# EAGLE schematic servo_1 (EAGLE 6.5.0)
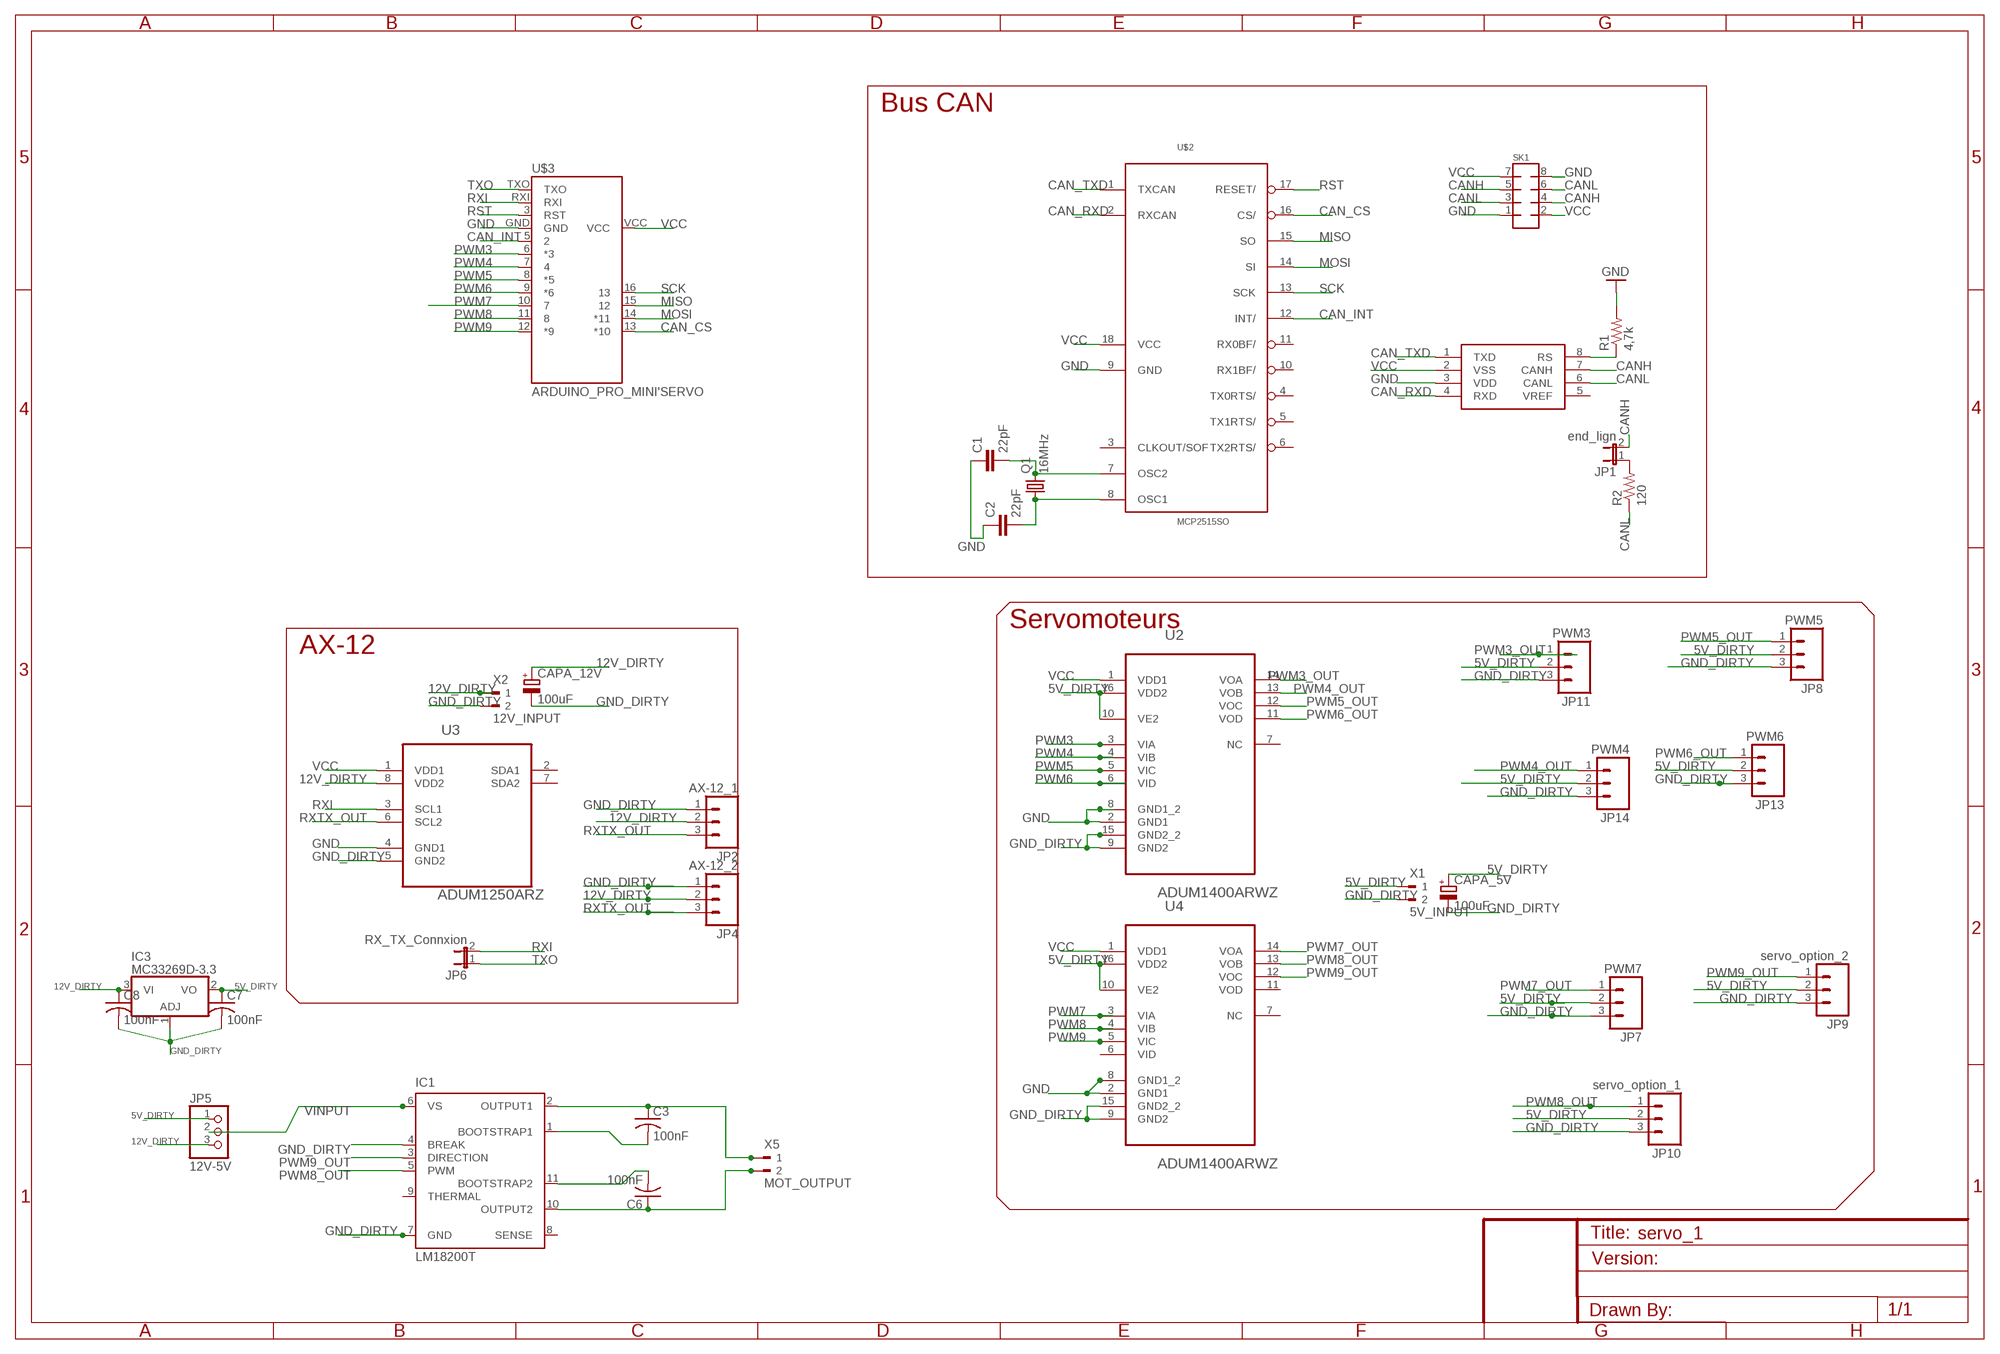
[diagram p0: schematic, sheet 1]

## Parts
C1  22pF  CAP0805  [0805]
C2  22pF  CAP0805  [0805]
C3  100nF  C-USC0805  [C0805]
C6  100nF  C-USC0805  [C0805]
C7  100nF  C-USC0805  [C0805]
C8  100nF  C-USC0805  [C0805]
CAPA_5V  100uF  CPOL-EUE5-8.5  [E5-8,5]
CAPA_12V  100uF  CPOL-EUE5-8.5  [E5-8,5]
IC1  LM18200T  [TO-220-11]
IC3  MC33269D-3.3  [DPACK]
JP1  end_lign  JUMPER-2PTH  [1X02]
JP2  AX-12_1  M03POLAR  [MOLEX-1X3]
JP4  AX-12_2  M03POLAR  [MOLEX-1X3]
JP5  12V-5V  PINHD-1X3  [1X03]
JP6  RX_TX_Connxion  JUMPER-2PTH  [1X02]
JP7  PWM7  M03PTH  [1X03]
JP8  PWM5  M03PTH  [1X03]
JP9  servo_option_2  M03PTH  [1X03]
JP10  servo_option_1  M03PTH  [1X03]
JP11  PWM3  M03PTH  [1X03]
JP13  PWM6  M03PTH  [1X03]
JP14  PWM4  M03PTH  [1X03]
Q1  16MHz  CRYSTALHC49S  [HC49/S]
R1  4,7k  RESISTOR0805-RES  [0805]
R2  120  RESISTOR0805-RES  [0805]
SK1  MMATCH-8-PTH  [AMP-215079-8]
U1  MCP2551  [SO08]
U2  ADUM1400ARWZ  [SOIC127P1032X265-16N]
U3  ADUM1250ARZ  [SOIC127P600X175-8N]
U4  ADUM1400ARWZ  [SOIC127P1032X265-16N]
U$2  MCP2515SO  [SO18L]
U$3  ARDUINO_PRO_MINI'SERVO  [ARDUINO_PRO_MINI]
X1  5V_INPUT  90-2  [90-2]
X2  12V_INPUT  90-2  [90-2]
X5  MOT_OUTPUT  90-2  [90-2]

## Nets
5V_DIRTY: C7.1 CAPA_5V.+ IC3.2(VO) JP5.1 JP7.2 JP8.2 JP9.2 JP10.2 JP11.2 JP13.2 JP14.2 U2.10(VE2) U2.16(VDD2) U4.10(VE2) U4.16(VDD2) X1.1
12V_DIRTY: C8.1 CAPA_12V.+ IC3.3(VI) JP2.2 JP4.2 JP5.3 U3.8(VDD2) X2.1
CAN_CS: U$2.16(CS/) U$3.13(*10)
CAN_INT: U$2.12(INT/) U$3.5
CAN_RXD: U1.4(RXD) U$2.2(RXCAN)
CAN_TXD: U1.1(TXD) U$2.1(TXCAN)
CANH: JP1.2 SK1.4 SK1.5 U1.7(CANH)
CANL: R2.1 SK1.3 SK1.6 U1.6(CANL)
GND: C1.1 C2.1 R1.2 SK1.1 SK1.8 U1.3(VDD) U2.2(GND1) U2.8(GND1_2) U3.4(GND1) U4.2(GND1) U4.8(GND1_2) U$2.9(GND) U$3.GND
GND_DIRTY: C7.2 C8.2 CAPA_5V.- CAPA_12V.- IC1.4(BREAK) IC1.7(GND) IC3.1(ADJ) JP2.1 JP4.1 JP7.3 JP8.3 JP9.3 JP10.3 JP11.3 JP13.3 JP14.3 U2.9(GND2) U2.15(GND2_2) U3.5(GND2) U4.9(GND2) U4.15(GND2_2) X1.2 X2.2
MISO: U$2.15(SO) U$3.15
MOSI: U$2.14(SI) U$3.14(*11)
N$1: C3.2 IC1.1(BOOTSTRAP1)
N$2: C1.2 Q1.2 U$2.7(OSC2)
N$3: C2.2 Q1.1 U$2.8(OSC1)
N$4: C6.2 IC1.11(BOOTSTRAP2)
N$5: R1.1 U1.8(RS)
N$7: JP1.1 R2.2
N$9: C3.1 IC1.2(OUTPUT1) X5.1
N$10: C6.1 IC1.10(OUTPUT2) X5.2
PWM3: U2.3(VIA) U$3.6(*3)
PWM3_OUT: JP11.1 U2.14(VOA)
PWM4: U2.4(VIB) U$3.7
PWM4_OUT: JP14.1 U2.13(VOB)
PWM5: U2.5(VIC) U$3.8(*5)
PWM5_OUT: JP8.1 U2.12(VOC)
PWM6: U2.6(VID) U$3.9(*6)
PWM6_OUT: JP13.1 U2.11(VOD)
PWM7: U4.3(VIA) U$3.10
PWM7_OUT: JP7.1 U4.14(VOA)
PWM8: U4.4(VIB) U$3.11
PWM8_OUT: IC1.5(PWM) JP10.1 U4.13(VOB)
PWM9: U4.5(VIC) U$3.12(*9)
PWM9_OUT: IC1.3(DIRECTION) JP9.1 U4.12(VOC)
RST: U$2.17(RESET/) U$3.3(RST)
RXI: JP6.2 U3.3(SCL1) U$3.RXI
RXTX_OUT: JP2.3 JP4.3 U3.6(SCL2)
SCK: U$2.13(SCK) U$3.16
TXO: JP6.1 U$3.TXO
VCC: SK1.2 SK1.7 U1.2(VSS) U2.1(VDD1) U3.1(VDD1) U4.1(VDD1) U$2.18(VCC) U$3.VCC
VINPUT: IC1.6(VS) JP5.2
Unconnected: IC1.8(SENSE) IC1.9(THERMAL) U1.5(VREF) U2.7(NC) U3.2(SDA1) U3.7(SDA2) U4.6(VID) U4.7(NC) U4.11(VOD) U$2.3(CLKOUT/SOF) U$2.4(TX0RTS/) U$2.5(TX1RTS/) U$2.6(TX2RTS/) U$2.10(RX1BF/) U$2.11(RX0BF/)

## Notes on the sheet
- Bus CAN
- Servomoteurs
- AX-12

## Library data of the parts
C1 C2 = SparkFun-Capacitors:CAP: Capacitor Standard 0603 ceramic capacitor, and 0.1" leaded capacitor.
C3 C6-C8 = resistor:C-US: CAPACITOR, American symbol
CAPA_5V CAPA_12V = resistor:CPOL-EU: POLARIZED CAPACITOR, European symbol
IC1 = national-semiconductor:LM18200T: 3A, 55V H-Bridge Motor Control SourcE: http://cache.national.com/ds/LM/LMD18200.pdf; OC_FARNELL: unknown; OC_NEWARK: unknown
IC3 = linear:MC33269?*: Adjustable Output Low Dropout Voltage Regulator 800 mA Source: http://www.onsemi.com/pub/Collateral/MC33269-D.PDF
JP1 JP6 = SparkFun-Passives:JUMPER-2: Jumper Basic 0.1" spaced jumper. Use with breakaway headers.
JP2 JP4 JP7-JP11 JP13 JP14 = SparkFun-Connectors:M03: Header 3 Standard 3-pin 0.1" header. Use with straight break away headers (SKU : PRT-00116), right angle break away headers (PRT-00553), swiss pins (PRT-00743), machine pins (PRT-00117), and female headers (PRT-00115). Molex polarized connector foot print use with SKU : PRT-08232 with associated crimp pins and housings.
JP5 = adafruit:PINHD-1X3: PIN HEADER
Q1 = adafruit:CRYSTAL: CRYSTAL; OC_FARNELL: 1667008; OC_NEWARK: unknown
R1 R2 = SparkFun-Passives:RESISTOR: Resistor Basic schematic elements and footprints for 0603, 1206, and PTH resistors.
SK1 = jt-con-micromatch:MMATCH-8-*: AMP Micromatch 8-pin
U1 = SparkFun-DigitalIC:MCP2551: CAN transceiver
U2 U4 = Analog Devices_By_element14_Batch_1:ADUM1400ARWZ: Quad-Channel Digital Isolators; MPN: ADUM1400ARWZ; OC_FARNELL: 1226217; OC_NEWARK: 19M8755; PACKAGE: SOIC-16; SUPPLIER: Analog Devices
U3 = Analog Devices_By_element14_Batch_1:ADUM1250ARZ: Hot Swappable, Dual I2C Isolators; MPN: ADUM1250ARZ; OC_FARNELL: 1814353; OC_NEWARK: 27M9880; PACKAGE: SOIC-8; SUPPLIER: Analog Devices
U$2 = MCP2515_MT:MCP2515*: MCP2515 Standalone CAN-Controller by Microchip Eagle-Lib. by MartinThomas
U$3 = can_bus_servo:ARDUINO_PRO_MINI
X1 X2 X5 = con-weidmueller-sl35:90-2: WEIDMUELLER CLAMP CONNECTOR; OC_FARNELL: unknown; OC_NEWARK: unknown

## Net classes
0 default: clearance 0.205 mm